# Altium schematic sheet Top.SchDoc
size A4
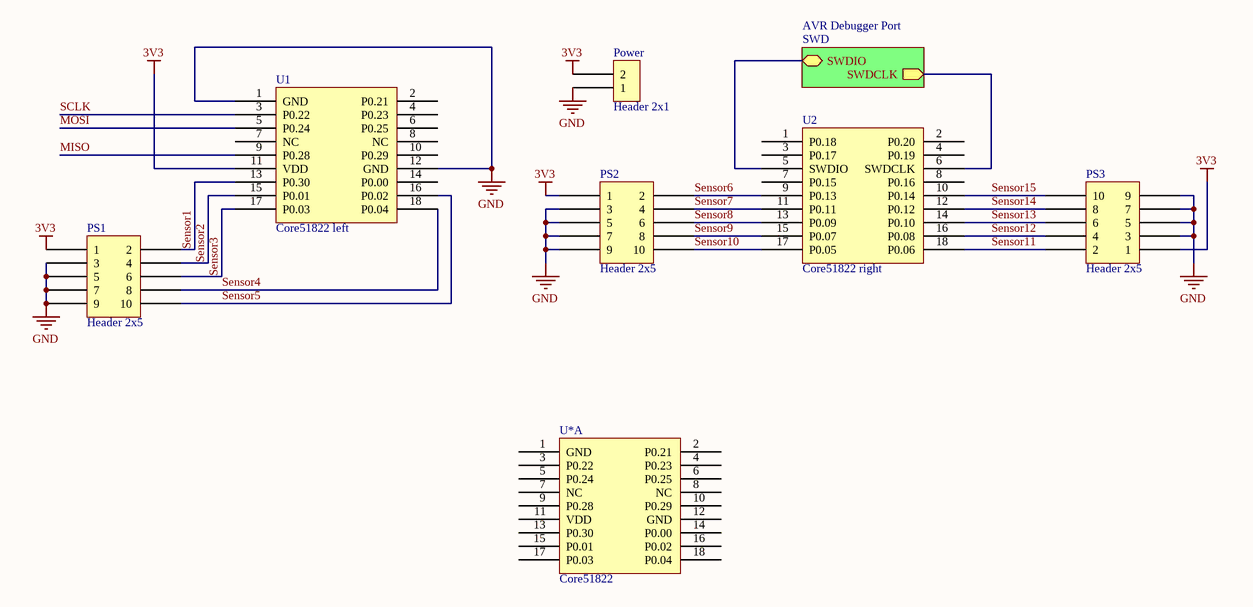
[diagram p0: Top.SchDoc]

## Parts
Power  Header 2x1  [Screw terminal 2 pin RM 5mm]
PS1  Header 2x5  [Header 2x5 IDC SMT]
PS2  Header 2x5  [Header 2x5 IDC SMT]
PS3  Header 2x5  [Header 2x5 IDC SMT]
U1  Core51822 left  [Header 2.00 2x9 SMD]
U2  Core51822 right  [Header 2.00 2x9 SMD]
U*  Core51822  [Core51822 Layout]  (part A of 2)

## Sub-sheets
AVR Debugger Port = SWD: SWDIO (bidir), SWDCLK (out)

## Nets
3V3: Power.2 PS1.1 PS2.1 PS3.1 U1.11(VDD)
GND: Power.1 PS1.3 PS1.5 PS1.7 PS1.9 PS2.3 PS2.5 PS2.7 PS2.9 PS3.3 PS3.5 PS3.7 PS3.9 U1.1(GND) U1.12(GND)
MISO: U1.9(P0.28)
MOSI: U1.5(P0.24)
SCLK: U1.3(P0.22)
Sensor1: PS1.2 U1.13(P0.30)
Sensor2: PS1.4 U1.15(P0.01)
Sensor3: PS1.6 U1.17(P0.03)
Sensor4: PS1.8 U1.18(P0.04)
Sensor5: PS1.10 U1.16(P0.02)
Sensor6: PS2.2 U2.9(P0.13)
Sensor7: PS2.4 U2.11(P0.11)
Sensor8: PS2.6 U2.13(P0.09)
Sensor9: PS2.8 U2.15(P0.07)
Sensor10: PS2.10 U2.17(P0.05)
Sensor11: PS3.2 U2.18(P0.06)
Sensor12: PS3.4 U2.16(P0.08)
Sensor13: PS3.6 U2.14(P0.10)
Sensor14: PS3.8 U2.12(P0.12)
Sensor15: PS3.10 U2.10(P0.14)
NetU2_5: U2.5(SWDIO) ; sheet AVR Debugger Port/SWDIO
NetU2_6: U2.6(SWDCLK) ; sheet AVR Debugger Port/SWDCLK

Not connected (* = marked no-connect by the designer): U1 2(P0.21) 4(P0.23) 6(P0.25) 7(NC) 8(NC) 10(P0.29) 14(P0.00); U2 1(P0.18) 2(P0.20) 3(P0.17) 4(P0.19) 7(P0.15) 8(P0.16); U* 1(GND) 2(P0.21) 3(P0.22) 4(P0.23) 5(P0.24) 6(P0.25) 7(NC) 8(NC) 9(P0.28) 10(P0.29) 11(VDD) 12(GND) 13(P0.30) 14(P0.00) 15(P0.01) 16(P0.02) 17(P0.03) 18(P0.04)